# Altium schematic sheet MIXR Power - Battery Management.SchDoc: Title
size B; Organization: Midnight Sun Solar Rayce Car Team; Address1: University of Waterloo; Address2: 200 University Ave W; Address3: Waterloo, ON, Canada; Address4: N2L 3E9; Website: www.uwmidsun.com; ProjectName: ProjectName
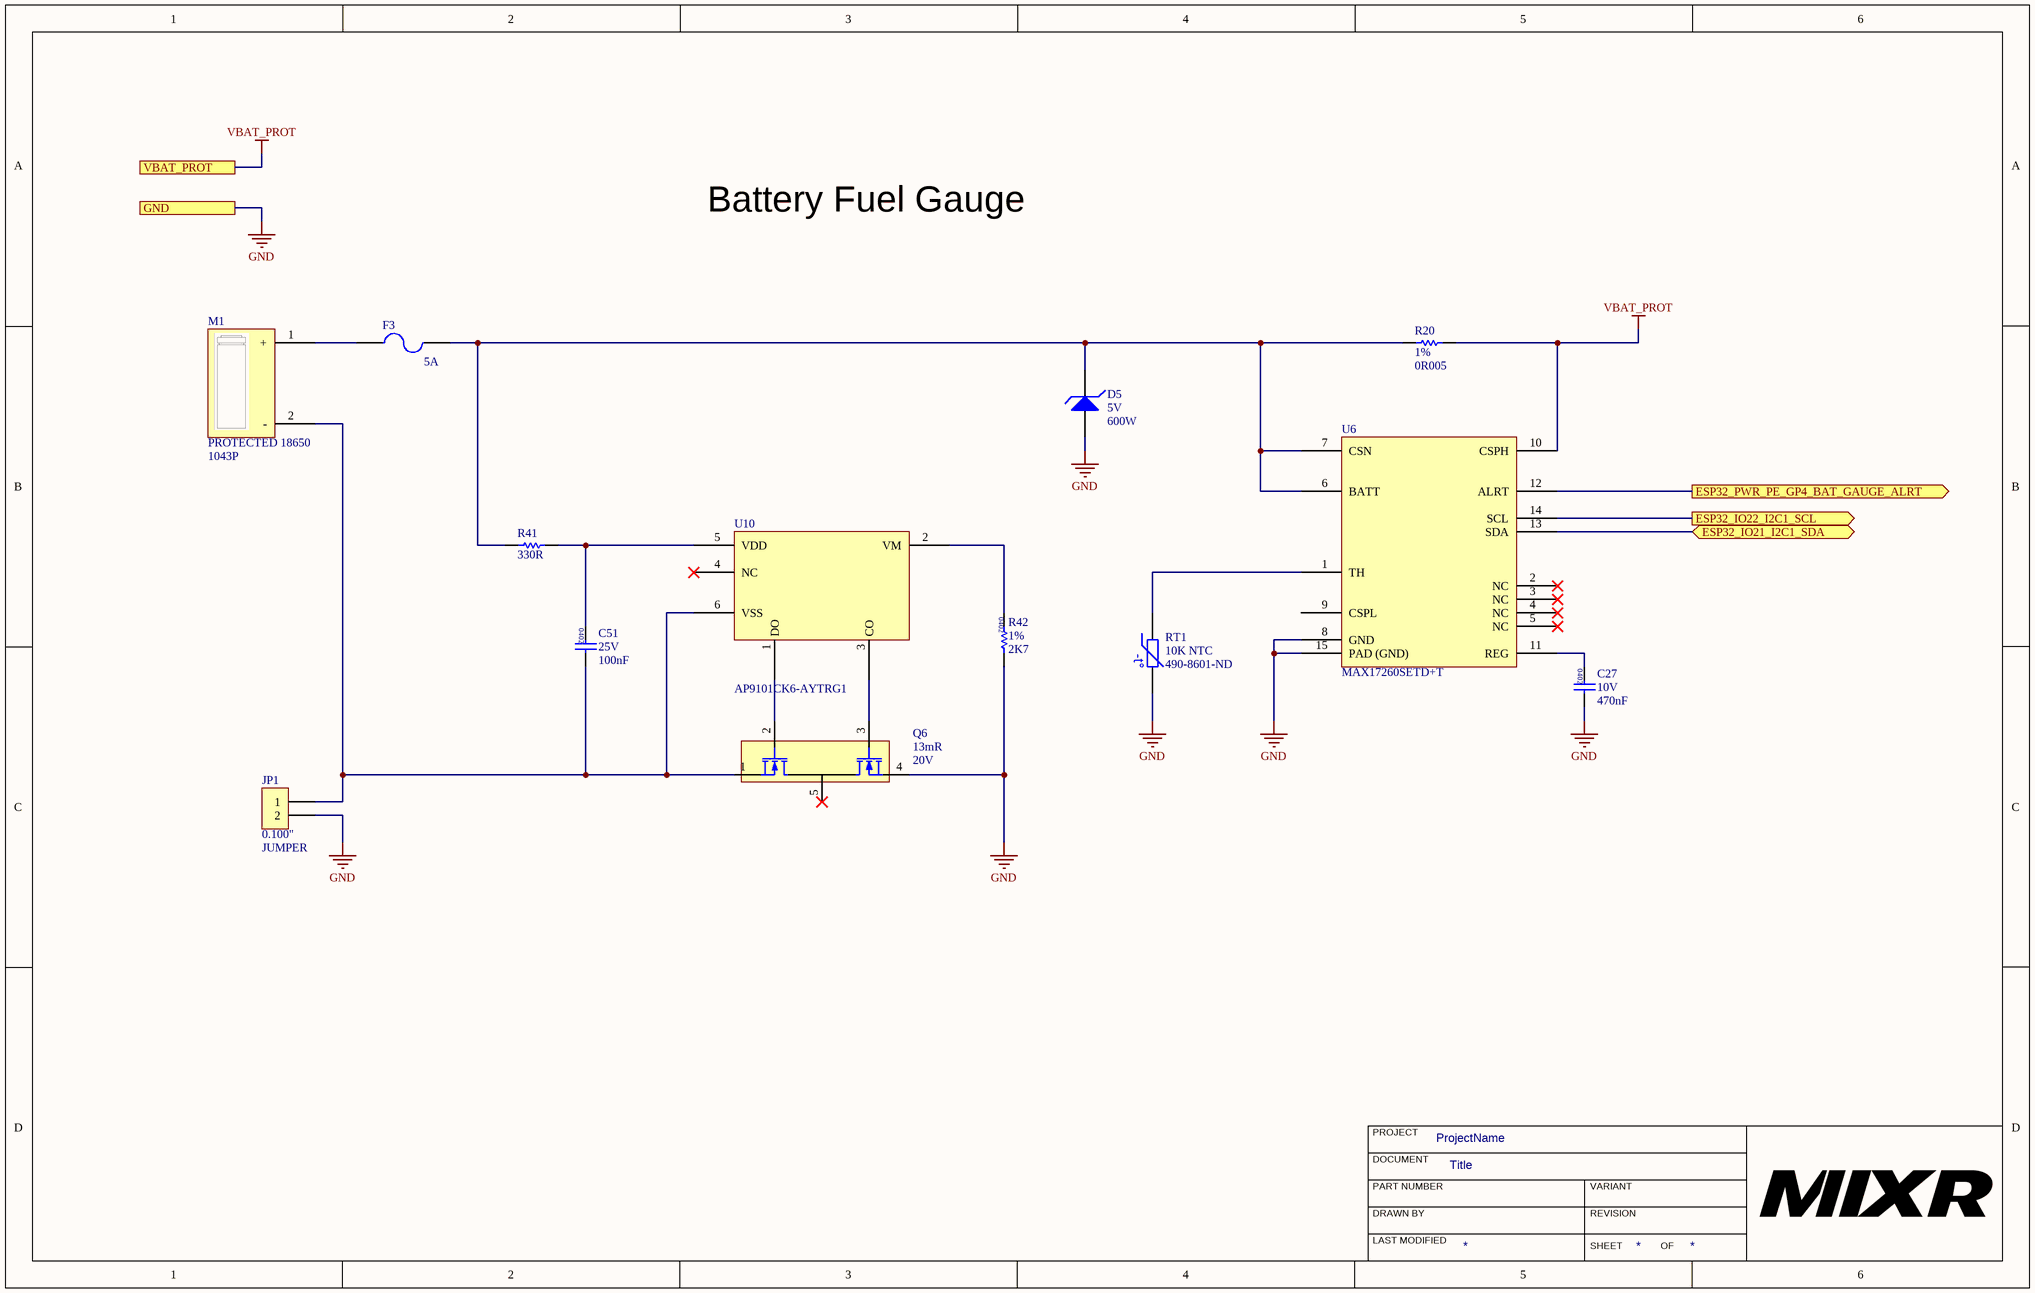
[diagram p0: MIXR Power - Battery Management.SchDoc]

## Parts
C27  Voltage Rating: 10V  Capacitance: 470nF  [CAP 0402]  (hidden comment: CAP CER 0.47UF 10V X7R 0402)
C51  Voltage: 25V  Capacitance: 100nF  [CAP 0402]  (hidden comment: CAP CER 0.1UF 16V X7R 0402)
D5  Voltage - Reverse Standoff (Typ): 5V  Power - Peak Pulse: 600W  [DO-214AA Diode]  (hidden comment: DIODE TVS 5VWM 9.1VC DO-214AA (SMB))
F3  Current Rating: 5A  [FUSE LITTLEFUSE 0466 1206]  (hidden comment: FUSE 5A 32VDC 1206)
JP1  Row Spacing - Mating: 0.100"  [CONN, 2POS JUMPER 0.1"]  (hidden comment: JUMPER)
M1  PROTECTED 18650  Manufacturer Part Number: 1043P  [BATTERY HOLDER 18650 PC PIN]
Q6  Rds On Max: 13mR  Drain to Source Voltage (Vdss): 20V  [MOSFET 2N-CH 6-UDFN]  (hidden comment: MOSFET 2N-CH 20V 9A 6-UDFN)
R20  Tolerance: 1%  Resistance: 0R005  [RES CRF0805]  (hidden comment: RES 0.005 OHM 1% 1/2W 0805)
R41  Manufacturer Part Number: 330R  [RES, 0603]  (hidden comment: RES 330 OHM 1% 1/10W 0603)
R42  Tolerance: 1%  Resistance: 2K7  [RES 0402]  (hidden comment: RES 2.7K OHM 1% 1/16W 0402)
RT1  10K NTC  Supplier Part Number 1: 490-8601-ND  [NTC THERMISTOR BEAD]
U6  Manufacturer Part Number: MAX17260SETD+T  [QFN40P300X300X80_HS-15M]  (hidden comment: IC BATT FUEL GAUGE LI-ION 14-DFN)
U10  Manufacturer Part Number: AP9101CK6-AYTRG1  [SOT23-6]  (hidden comment: IC BATT PROT LI-ION 1-CELL SOT26)

## Ports
ESP32_IO21_I2C1_SDA (bidir), ESP32_IO22_I2C1_SCL (out), ESP32_PWR_PE_GP4_BAT_GAUGE_ALRT (out), GND, VBAT_PROT

## Nets
GND: C27.2 D5.1 JP1.2 Q6.4(S2) R42.2 RT1.2 U6.8(GND) U6.15(PAD_(GND)) ; port GND
VBAT_PROT: R20.2 U6.10(CSPH) ; port VBAT_PROT
ESP32_IO21_I2C1_SDA: U6.13(SDA) ; port ESP32_IO21_I2C1_SDA
ESP32_IO22_I2C1_SCL: U6.14(SCL) ; port ESP32_IO22_I2C1_SCL
ESP32_PWR_PE_GP4_BAT_GAUGE_ALRT: U6.12(ALRT) ; port ESP32_PWR_PE_GP4_BAT_GAUGE_ALRT
NetC27_1: C27.1 U6.11(REG)
NetC51_1: C51.1 R41.2 U10.5(VDD)
NetC51_2: C51.2 JP1.1 M1.2(-) Q6.1(S1) U10.6(VSS)
NetD5_2: D5.2 F3.2 R20.1 R41.1 U6.6(BATT) U6.7(CSN)
NetF3_1: F3.1 M1.1(+)
NetQ6_2: Q6.2(G1) U10.1(DO)
NetQ6_3: Q6.3(G2) U10.3(CO)
NetR42_1: R42.1 U10.2(VM)
NetRT1_1: RT1.1 U6.1(TH)

Not connected (* = marked no-connect by the designer): Q6 5(D)*; U6 2(NC)* 3(NC)* 4(NC)* 5(NC)* 9(CSPL); U10 4(NC)*

## Notes on the sheet
- Battery Fuel Gauge
- PROJECT
- DOCUMENT
- DRAWN BY
- LAST MODIFIED
- PART NUMBER
- REVISION
- SHEET
- VARIANT
- OF
- (in symbol NTC THERMISTOR 10K 1% BEAD) -t°

## Library data of the parts
C27 = CAP CER 0.47UF 10V X7R 0402: CAP ,MLCC ,0402,6.3V,X7R,0.47uF, 10% ,T&R;; Manufacturer: Taiyo Yuden; Manufacturer Part Number: LMK105B7474KV-F; Supplier 1: Digi-Key; RoHS: Yes; Category: Ceramic Capacitors; Stock 1: 68675; Pricing 1: 1=0.25000, 10=0.17500, 100=0.09890, 500=0.06982, 1000=0.06110, 2500=0.05819, 5000=0.05383 (USD); Mount: Surface Mount; Case/Package: 0402; Min Operating Temperature: -55°C; Max Operating Temperature: 125°C; Packaging: Tape and Reel; Tolerance: 10%; Voltage Rating (DC): 10V; Length: 0.039inch; Width: 0.02inch; Thickness: 0.022inch; Halogen Free: Halogen Free; ComponentLink1URL: http://www.yuden.co.jp/productdata/catalog/en/mlcc_all_e.pdf?src-supplier=Digi-Key; ComponentLink1Description: http://www.yuden.co.jp/productdata/catalog/en/mlcc_all_e.pdf?src-supplier=Digi-Key; ComponentLink2URL: http://ds.yuden.co.jp/TYCOMPAS/ut/detail.do?productNo=LMK105B7474KV-F&fileName=LMK105B7474KV-F_SS&mode=specSheetDownload&src-supplier=Digi-Key; ComponentLink2Description: http://ds.yuden.co.jp/TYCOMPAS/ut/detail.do?productNo=LMK105B7474KV-F&fileName=LMK105B7474KV-F_SS&mode=specSheetDownload&src-supplier=Digi-Key; ComponentLink3URL: https://www.yuden.co.jp/productdata/catalog/mlcc01_e.pdf?src-supplier=Digi-Key; ComponentLink3Description: https://www.yuden.co.jp/productdata/catalog/mlcc01_e.pdf?src-supplier=Digi-Key; Supplier Part Number 1: 587-5912-1-ND
C51 = CAP CER 0.1UF 16V X7R 0402: Cap Ceramic 0.1uF 25V X7R 10% SMD 0402 125C Paper T/R; Manufacturer: Murata; Manufacturer Part Number: GRM155R71E104KE14D; Supplier 1: Digi-Key; RoHS: Yes; Category: Ceramic Capacitors; Stock 1: 785540; Pricing 1: 1=0.10000, 10=0.03400, 100=0.01520, 500=0.01088, 1000=0.00855, 2500=0.00778, 5000=0.00715 (USD); Mount: Surface Mount; Case/Package: 0402; Weight: 0.000212oz; Case Code (Metric): 1005; Case Code (Imperial): 0402; Dielectric Material: Ceramic; Min Operating Temperature: -55°C; Max Operating Temperature: 125°C; Packaging: Tape and Reel; Tolerance: 10%; Termination: SMD/SMT; Composition: Ceramic; Package Quantity: 10000; Length: 1mm; Height: 0.5mm; Width: 0.02inch; Thickness: 0.022inch; Depth: 0.5mm; REACH SVHC: Unknown; Lead Free: Lead Free; ComponentLink1URL: http://www.farnell.com/datasheets/2048008.pdf?src-supplier=Farnell; ComponentLink1Description: http://www.farnell.com/datasheets/2048008.pdf?src-supplier=Farnell; ComponentLink2URL: http://uk.rs-online.com/webdocs/144c/0900766b8144c113.pdf?src-supplier=RSComponents; ComponentLink2Description: http://uk.rs-online.com/webdocs/144c/0900766b8144c113.pdf?src-supplier=RSComponents; ComponentLink3URL: http://www.farnell.com/datasheets/1872206.pdf?src-supplier=Farnell; ComponentLink3Description: http://www.farnell.com/datasheets/1872206.pdf?src-supplier=Farnell; ComponentLink4URL: http://components.arrow.com/part/dataview/0323_06361249?src-supplier=Arrow+Europe; ComponentLink4Description: http://components.arrow.com/part/dataview/0323_06361249?src-supplier=Arrow+Europe; ComponentLink5URL: http://www.mouser.com/ds/2/281/c02e-2905.pdf?src-supplier=Mouser; ComponentLink5Description: http://www.mouser.com/ds/2/281/c02e-2905.pdf?src-supplier=Mouser; ComponentLink6URL: http://www.farnell.com/datasheets/2048008.pdf?src-supplier=Newark; ComponentLink6Description: http://www.farnell.com/datasheets/2048008.pdf?src-supplier=Newark; ComponentLink7URL: http://psearch.en.murata.com/capacitor/product/GRM155R71E104KE14%23.pdf?src-supplier=Avnet; ComponentLink7Description: http://psearch.en.murata.com/capacitor/product/GRM155R71E104KE14%23.pdf?src-supplier=Avnet; ComponentLink8URL: https://search.murata.co.jp/Ceramy/image/img/A01X/G101/ENG/GRM155R71E104KE14-01.pdf?src-supplier=Digi-Key; ComponentLink8Description: https://search.murata.co.jp/Ceramy/image/img/A01X/G101/ENG/GRM155R71E104KE14-01.pdf?src-supplier=Digi-Key; ComponentLink9URL: http://www.farnell.com/datasheets/2048008.pdf?src-supplier=Element14; ComponentLink9Description: http://www.farnell.com/datasheets/2048008.pdf?src-supplier=Element14; Supplier Part Number 1: 490-10698-1-ND; Dielectric: X7R; Voltage Rating (DC): 25V; Voltage Rating: 25V
D5 = DIODE TVS 5VWM 9.1VC DO-214AA (SMB): TVS DIODE 5V 9.1V DO214AA; Manufacturer: Vishay Semiconductor Diodes Division; Manufacturer Part Number: SMBJ5.0D-M3/H; Type: Zener; Voltage - Breakdown (Min): 6.5V; Current - Peak Pulse (10/1000µs): 65.9A; Power Line Protection: No; Supplier 1: Digi-Key; RoHS: RoHS Compliant; Category: Circuit Protection; Stock 1: 6900; Pricing 1: 1=0.51, 10=0.416, 25=0.3808, 100=0.2833, 250=0.25668 (CAD); Packaging: Cut Tape (CT); Part Status: Active; Voltage - Clamping (Max) @ Ipp: 9.1V; Applications: General Purpose; Capacitance @ Frequency: -; Operating Temperature: -55°C ~ 150°C (TJ); Mounting Type: Surface Mount; Package / Case: DO-214AA, SMB; Supplier Device Package: DO-214AA (SMBJ); ComponentLink1URL: http://www.vishay.com/docs/87606/87606.pdf; ComponentLink1Description: http://www.vishay.com/docs/87606/87606.pdf; Supplier Part Number 1: SMBJ5.0D-M3/HGICT-ND
F3 = FUSE 5A 32VDC 1206: FUSE 5.0A 125VAC FAST 1206; Manufacturer: Bel TRP; Manufacturer Part Number: C1F5; Voltage Rating (AC): 125V; Voltage Rating (DC): 63V; DC Cold Resistance: 19mR; Fuse Type: Board Mount (Cartridge Style Excluded); Approvals: CE,cURus; Supplier 1: Digi-Key; RoHS: Yes; Category: Fuses; Stock 1: 12696; Pricing 1: 1=0.29000, 5=0.27800, 10=0.26500, 50=0.23660, 100=0.22030, 250=0.19584, 500=0.16320, 1000=0.15504 (USD); Mount: Surface Mount; Number of Pins: 2; Case Code (Metric): 3216; Case Code (Imperial): 1206; Contact Plating: Tin; Min Operating Temperature: -55°C; Max Operating Temperature: 125°C; Packaging: Tape and Reel; Voltage Rating: 125V; Length: 0.126inch; Width: 0.062inch; ComponentLink1URL: http://www.mouser.com/ds/2/643/C1F-594910.pdf?src-supplier=Mouser; ComponentLink1Description: http://www.mouser.com/ds/2/643/C1F-594910.pdf?src-supplier=Mouser; ComponentLink2URL: http://belfuse.com/pdfs/C1F.pdf?src-supplier=Avnet; ComponentLink2Description: http://belfuse.com/pdfs/C1F.pdf?src-supplier=Avnet; ComponentLink3URL: https://belfuse.com/resources/datasheets/circuitprotection/ds-cp-c1f-series.pdf?src-supplier=Digi-Key; ComponentLink3Description: https://belfuse.com/resources/datasheets/circuitprotection/ds-cp-c1f-series.pdf?src-supplier=Digi-Key; Supplier Part Number 1: 507-1886-1-ND; Case/Package: 1206
JP1 = CONN 2POS JUMPER 0.1": 2 Positions Header Connector Through Hole Gold; Manufacturer: Omron Electronics Inc-EMC Div; Manufacturer Part Number: XG8T-0231; Style: Board to Board or Cable; Shrouding: Unshrouded; Number of Positions: 2; Number of Positions Loaded: All; Contact Length - Mating: 0.169" (4.30mm); Contact Length - Post: 0.118" (3.00mm); Overall Contact Length: 0.386" (9.80mm); Material Flammability Rating: UL94 V-0; Current Rating: 2A; Voltage Rating: 300V; Supplier 1: Digi-Key; RoHS: RoHS Compliant; Category: Connectors, Interconnects; Stock 1: 9094; Pricing 1: 1=0.28, 10=0.265, 100=0.183, 500=0.15484, 1000=0.12668, 5000=0.11261, 10000=0.10205 (CAD); Packaging: Bulk; Part Status: Active; Connector Type: Header; Contact Type: Male Pin; Pitch - Mating: -; Number of Rows: 2; Mounting Type: Through Hole; Termination: Solder; Fastening Type: -; Insulation Height: 0.098" (2.50mm); Contact Shape: Square; Contact Finish - Mating: Gold; Contact Finish Thickness - Mating: 5.9µin (0.15µm); Contact Finish - Post: Tin; Contact Material: Brass, Nickel; Insulation Material: Polybutylene Terephthalate (PBT), Glass Filled; Features: -; Operating Temperature: -55°C ~ 105°C; Ingress Protection: -; Insulation Color: Black; Mated Stacking Heights: -; Contact Finish Thickness - Post: -; Applications: -; ComponentLink1URL: http://www.omron.com/ecb/products/pdf/en-xj8.pdf; ComponentLink1Description: http://www.omron.com/ecb/products/pdf/en-xj8.pdf; Supplier Part Number 1: XG8T-0231-ND; Type: JUMPER
M1 = BATTERY HOLDER 18650: BATTERY HOLDER 18650 PC PIN; Manufacturer: Keystone Electronics; Number of Cells: 1; Supplier 1: Digi-Key; RoHS: Yes; Category: Uncategorized; Stock 1: 6353; Pricing 1: 1=2.58000, 25=2.16760, 100=1.91000, 250=1.82000, 500=1.67000, 1000=1.52000, 2500=1.30900, 5000=1.19000 (USD); Mount: Through Hole,PCB; Min Operating Temperature: -50°C; Max Operating Temperature: 145°C; Package Quantity: 50; Termination: PC Pin; Packaging: Tray; ComponentLink1URL: https://datasheet.ciiva.com/41860/1043p-41860216.pdf?src-supplier=Digi-Key; ComponentLink1Description: https://datasheet.ciiva.com/41860/1043p-41860216.pdf?src-supplier=Digi-Key; Supplier Part Number 1: 36-1043P-ND
Q6 = MOSFET 2N-CH 20V 9A 6-UDFN: Manufacturer: Diodes; Manufacturer Part Number: DMN2014LHAB-7; Input Capacitance: 1.55nF; Rise Time: 15.5ns; Continuous Drain Current (ID): 9.3A; Max Power Dissipation: 800mW; Drain to Source Resistance: 28mR; Turn-Off Delay Time: 40.9ns; Turn-On Delay Time: 6.9ns; Fall Time: 12ns; Gate to Source Voltage (Vgs): 12V; FET Type: 2 N-Channel; Supplier 1: Digi-Key; RoHS: Yes; Category: MOSFETs; Stock 1: 3087; Pricing 1: 1=0.51000, 10=0.43800, 100=0.30340, 500=0.23688, 1000=0.19254 (USD); Mount: Surface Mount; Case/Package: DFN; Number of Pins: 7; Min Operating Temperature: -55°C; Max Operating Temperature: 150°C; Package Quantity: 3000; Packaging: Tape and Reel; Length: 3.05mm; Height: 0.6mm; Width: 2.05mm; ComponentLink1URL: https://datasheet.ciiva.com/29590/dmn2014lhab-29590005.pdf?src-supplier=Digi-Key; ComponentLink1Description: https://datasheet.ciiva.com/29590/dmn2014lhab-29590005.pdf?src-supplier=Digi-Key; ComponentLink2URL: https://datasheet.ciiva.com/29590/dmn2014lhab-29590007.pdf?src-supplier=Digi-Key; ComponentLink2Description: https://datasheet.ciiva.com/29590/dmn2014lhab-29590007.pdf?src-supplier=Digi-Key; ComponentLink3URL: https://datasheet.ciiva.com/29590/dmn2014lhab-29590006.pdf?src-supplier=Digi-Key; ComponentLink3Description: https://datasheet.ciiva.com/29590/dmn2014lhab-29590006.pdf?src-supplier=Digi-Key; Supplier Part Number 1: DMN2014LHAB-7DICT-ND
R20 = RES 0.005 OHM 1% 1/2W 0805: 5 mOhms ±1% 0.5W, 1/2W Chip Resistor 0805 (2012 Metric) Automotive AEC-Q200, Current Sense, Moisture Resistant Metal Element; Manufacturer: Bourns; Manufacturer Part Number: CRF0805-FZ-R005ELF; Power Rating: 500mW; Temperature Coefficient: 75ppm/°C; Supplier 1: Digi-Key; RoHS: Yes; Category: Chip SMD Resistors; Stock 1: 12417; Pricing 1: 1=0.54000, 10=0.41700, 100=0.17550, 1000=0.09680, 2500=0.09075 (USD); Case/Package: 0805; Weight: 0.000194oz; Case Code (Imperial): 0805; Case Code (Metric): 2012; Min Operating Temperature: -55°C; Max Operating Temperature: 170°C; Packaging: Tape and Reel; Package Quantity: 5000; Composition: Metal Film; Number of Terminations: 2; Termination: SMD/SMT; Max Power Dissipation: 500mW; Features: Moisture Resistant,Automotive AEC-Q200; Length: 0.079inch; Height: 0.6mm; Width: 0.049inch; Height - Seated (Max): 0.031inch; ComponentLink1URL: http://www.farnell.com/datasheets/2194442.pdf?src-supplier=Farnell; ComponentLink1Description: http://www.farnell.com/datasheets/2194442.pdf?src-supplier=Farnell; ComponentLink2URL: http://www.mouser.com/ds/2/54/rf-937137.pdf?src-supplier=Mouser; ComponentLink2Description: http://www.mouser.com/ds/2/54/rf-937137.pdf?src-supplier=Mouser; ComponentLink3URL: http://www.farnell.com/datasheets/2194442.pdf?src-supplier=Newark; ComponentLink3Description: http://www.farnell.com/datasheets/2194442.pdf?src-supplier=Newark; ComponentLink4URL: https://www.bourns.com/docs/Product-Datasheets/CRF.pdf?src-supplier=Digi-Key; ComponentLink4Description: https://www.bourns.com/docs/Product-Datasheets/CRF.pdf?src-supplier=Digi-Key; Supplier Part Number 1: CRF0805-FZ-R005ELFCT-ND
R41 = RES 330 OHM 1% 1/10W 0603: 330 Ohms ±1% 0.1W, 1/10W Chip Resistor 0603 (1608 Metric) Automotive AEC-Q200, Moisture Resistant Thick Film; Manufacturer: TE Connectivity; Supplier 1: Digi-Key; Supplier Part Number 1: A129682CT-ND; RoHS: No; Stock 1: 87700; Pricing 1: 1 = 0.10000, 10 = 0.03300, 100 = 0.01320, 1000 = 0.00595, 2500 = 0.00516 (USD); ComponentLink1URL: http://www.te.com/commerce/DocumentDelivery/DDEController?Action=srchrtrv&DocNm=1773204-3&DocType=DS&DocLang=English&src-supplier=Digi-Key; ComponentLink1Description: http://www.te.com/commerce/DocumentDelivery/DDEController?Action=srchrtrv&DocNm=1773204-3&DocType=DS&DocLang=English&src-supplier=Digi-Key; ComponentLink2URL: https://www.te.com/commerce/DocumentDelivery/DDEController?Action=srchrtrv&DocNm=1773204-3&DocType=DS&DocLang=English&src-supplier=Digi-Key; ComponentLink2Description: https://www.te.com/commerce/DocumentDelivery/DDEController?Action=srchrtrv&DocNm=1773204-3&DocType=DS&DocLang=English&src-supplier=Digi-Key
R42 = RES 2.7K OHM 1% 1/16W 0402: 2.7 kOhms ±1% 0.1W, 1/10W Chip Resistor 0402 (1005 Metric) Automotive AEC-Q200 Thick Film; Manufacturer: Panasonic; Manufacturer Part Number: ERJ-2RKF2701X; Temperature Coefficient: 100ppm/°C; Power Rating: 100mW; Voltage Rating: 50V; Supplier 1: Digi-Key; RoHS: Yes; Category: Chip SMD Resistors; Stock 1: 344590; Pricing 1: 1=0.10000, 10=0.04100, 100=0.01670, 1000=0.00751, 2500=0.00652, 5000=0.00538 (USD); Mount: Surface Mount; Case/Package: 0402; Number of Pins: 2; Contact Plating: Tin; Case Code (Metric): 1005; Case Code (Imperial): 0402; Min Operating Temperature: -55°C; Max Operating Temperature: 155°C; Composition: Thick Film; Packaging: Tape and Reel; Package Quantity: 1; Number of Terminations: 2; Termination: SMD/SMT; Military Standard: Not; Max Power Dissipation: 100mW; Voltage Rating (DC): 50V; Features: Automotive AEC-Q200; Length: 1mm; Height: 0.35mm; Width: 0.02inch; Depth: 0.5mm; Radiation Hardening: No; REACH SVHC: No SVHC; Lead Free: Lead Free; ComponentLink1URL: https://datasheet.ciiva.com/3883/3984280s8821682n1386-3883650.pdf?src-supplier=Arrow; ComponentLink1Description: https://datasheet.ciiva.com/3883/3984280s8821682n1386-3883650.pdf?src-supplier=Arrow; ComponentLink2URL: https://datasheet.ciiva.com/11821/0900766b80f80784-11821269.pdf?src-supplier=RSComponents; ComponentLink2Description: https://datasheet.ciiva.com/11821/0900766b80f80784-11821269.pdf?src-supplier=RSComponents; ComponentLink3URL: https://datasheet.ciiva.com/22668/1678782-22668310.pdf?src-supplier=Element14; ComponentLink3Description: https://datasheet.ciiva.com/22668/1678782-22668310.pdf?src-supplier=Element14; ComponentLink4URL: https://datasheet.ciiva.com/24071/aoa0000ce2-24071174.pdf?src-supplier=Mouser; ComponentLink4Description: https://datasheet.ciiva.com/24071/aoa0000ce2-24071174.pdf?src-supplier=Mouser; ComponentLink5URL: https://datasheet.ciiva.com/7802/aoa0000ce2-7802407.pdf?src-supplier=Element14; ComponentLink5Description: https://datasheet.ciiva.com/7802/aoa0000ce2-7802407.pdf?src-supplier=Element14; ComponentLink6URL: https://datasheet.ciiva.com/9196/aoa0000ce2-9196887.pdf?src-supplier=Avnet; ComponentLink6Description: https://datasheet.ciiva.com/9196/aoa0000ce2-9196887.pdf?src-supplier=Avnet; ComponentLink7URL: https://datasheet.ciiva.com/43467/1678782-43467351.pdf?src-supplier=Farnell; ComponentLink7Description: https://datasheet.ciiva.com/43467/1678782-43467351.pdf?src-supplier=Farnell; ComponentLink8URL: https://datasheet.ciiva.com/46372/1678782-46372856.pdf?src-supplier=Element14; ComponentLink8Description: https://datasheet.ciiva.com/46372/1678782-46372856.pdf?src-supplier=Element14; ComponentLink9URL: https://datasheet.ciiva.com/16775/70260748-16775161.pdf?src-supplier=Allied+Electronics; ComponentLink9Description: https://datasheet.ciiva.com/16775/70260748-16775161.pdf?src-supplier=Allied+Electronics; ComponentLink10URL: https://datasheet.ciiva.com/16778/70260748-16778345.pdf?src-supplier=Allied+Electronics; ComponentLink10Description: https://datasheet.ciiva.com/16778/70260748-16778345.pdf?src-supplier=Allied+Electronics; ComponentLink11URL: https://datasheet.ciiva.com/46372/1678782-46372857.pdf?src-supplier=Element14; ComponentLink11Description: https://datasheet.ciiva.com/46372/1678782-46372857.pdf?src-supplier=Element14; ComponentLink12URL: https://datasheet.ciiva.com/6138/aoa0000ce2-6138171.pdf?src-supplier=Farnell; ComponentLink12Description: https://datasheet.ciiva.com/6138/aoa0000ce2-6138171.pdf?src-supplier=Farnell; ComponentLink13URL: https://datasheet.ciiva.com/22687/1678782-22687069.pdf?src-supplier=Element14; ComponentLink13Description: https://datasheet.ciiva.com/22687/1678782-22687069.pdf?src-supplier=Element14; ComponentLink14URL: https://datasheet.ciiva.com/17213/aoa0000ce2-17213982.pdf?src-supplier=Avnet+Europe; ComponentLink14Description: https://datasheet.ciiva.com/17213/aoa0000ce2-17213982.pdf?src-supplier=Avnet+Europe; Supplier Part Number 1: P2.70KLCT-ND
RT1 = NTC THERMISTOR 10K 1% BEAD: NTC Thermistor 10k Bead; Manufacturer: Murata Electronics North America; Manufacturer Part Number: NXRT15XH103FA1B030; Resistance Tolerance: ±1%; B25/50: 3380K; B25/85: 3434K; B25/100: 3455K; Supplier 1: Digi-Key; RoHS: RoHS Compliant; Category: Sensors, Transducers; Stock 1: 25017; Pricing 1: 1=0.96, 5=0.91, 10=0.792, 25=0.696, 50=0.5784, 100=0.4925, 500=0.42834, 1000=0.3748, 5000=0.33197 (CAD); Packaging: Bulk; Part Status: Active; Resistance in Ohms @ 25°C: 10k; B Value Tolerance: ±1%; B0/50: -; B25/75: -; Operating Temperature: -40°C ~ 125°C; Length - Lead Wire: -; Mounting Type: Through Hole; Package / Case: Bead; ComponentLink1URL: https://www.murata.com/~/media/webrenewal/support/library/catalog/products/thermistor/ntc/r44e.ashx; ComponentLink1Description: https://www.murata.com/~/media/webrenewal/support/library/catalog/products/thermistor/ntc/r44e.ashx
U6 = IC BATT FUEL GAUGE LI-ION 14-DFN: Battery Management 5.1 A 1-Cell Fuel Gauge with ModelGauge m5 EZ and Optional High-SideCurrent Sensing; Manufacturer: Maxim; Supplier 1: Mouser; RoHS: No; Stock 1: 3038; Pricing 1: 1=2.39000, 10=2.26000, 25=1.80000, 50=1.71000, 100=1.58000, 250=1.50000, 500=1.45000, 1000=1.31000, 2500=1.07000 (USD); Supplier Part Number 1: 700-MAX17260SETD+T
U10 = IC BATT PROT LI-ION 1-CELL SOT26: Battery Battery Protection IC Lithium Ion/Polymer SOT-26; Manufacturer: Diodes; Supplier 1: Digi-Key; RoHS: No; Stock 1: 3484; Pricing 1: 1=0.45000, 10=0.36700, 100=0.24960, 500=0.18720, 1000=0.14040 (USD); Supplier Part Number 1: AP9101CK6-AYTRG1DICT-ND